# EAGLE schematic ArduinoUhr_VFD_2 (EAGLE 9.2.2)
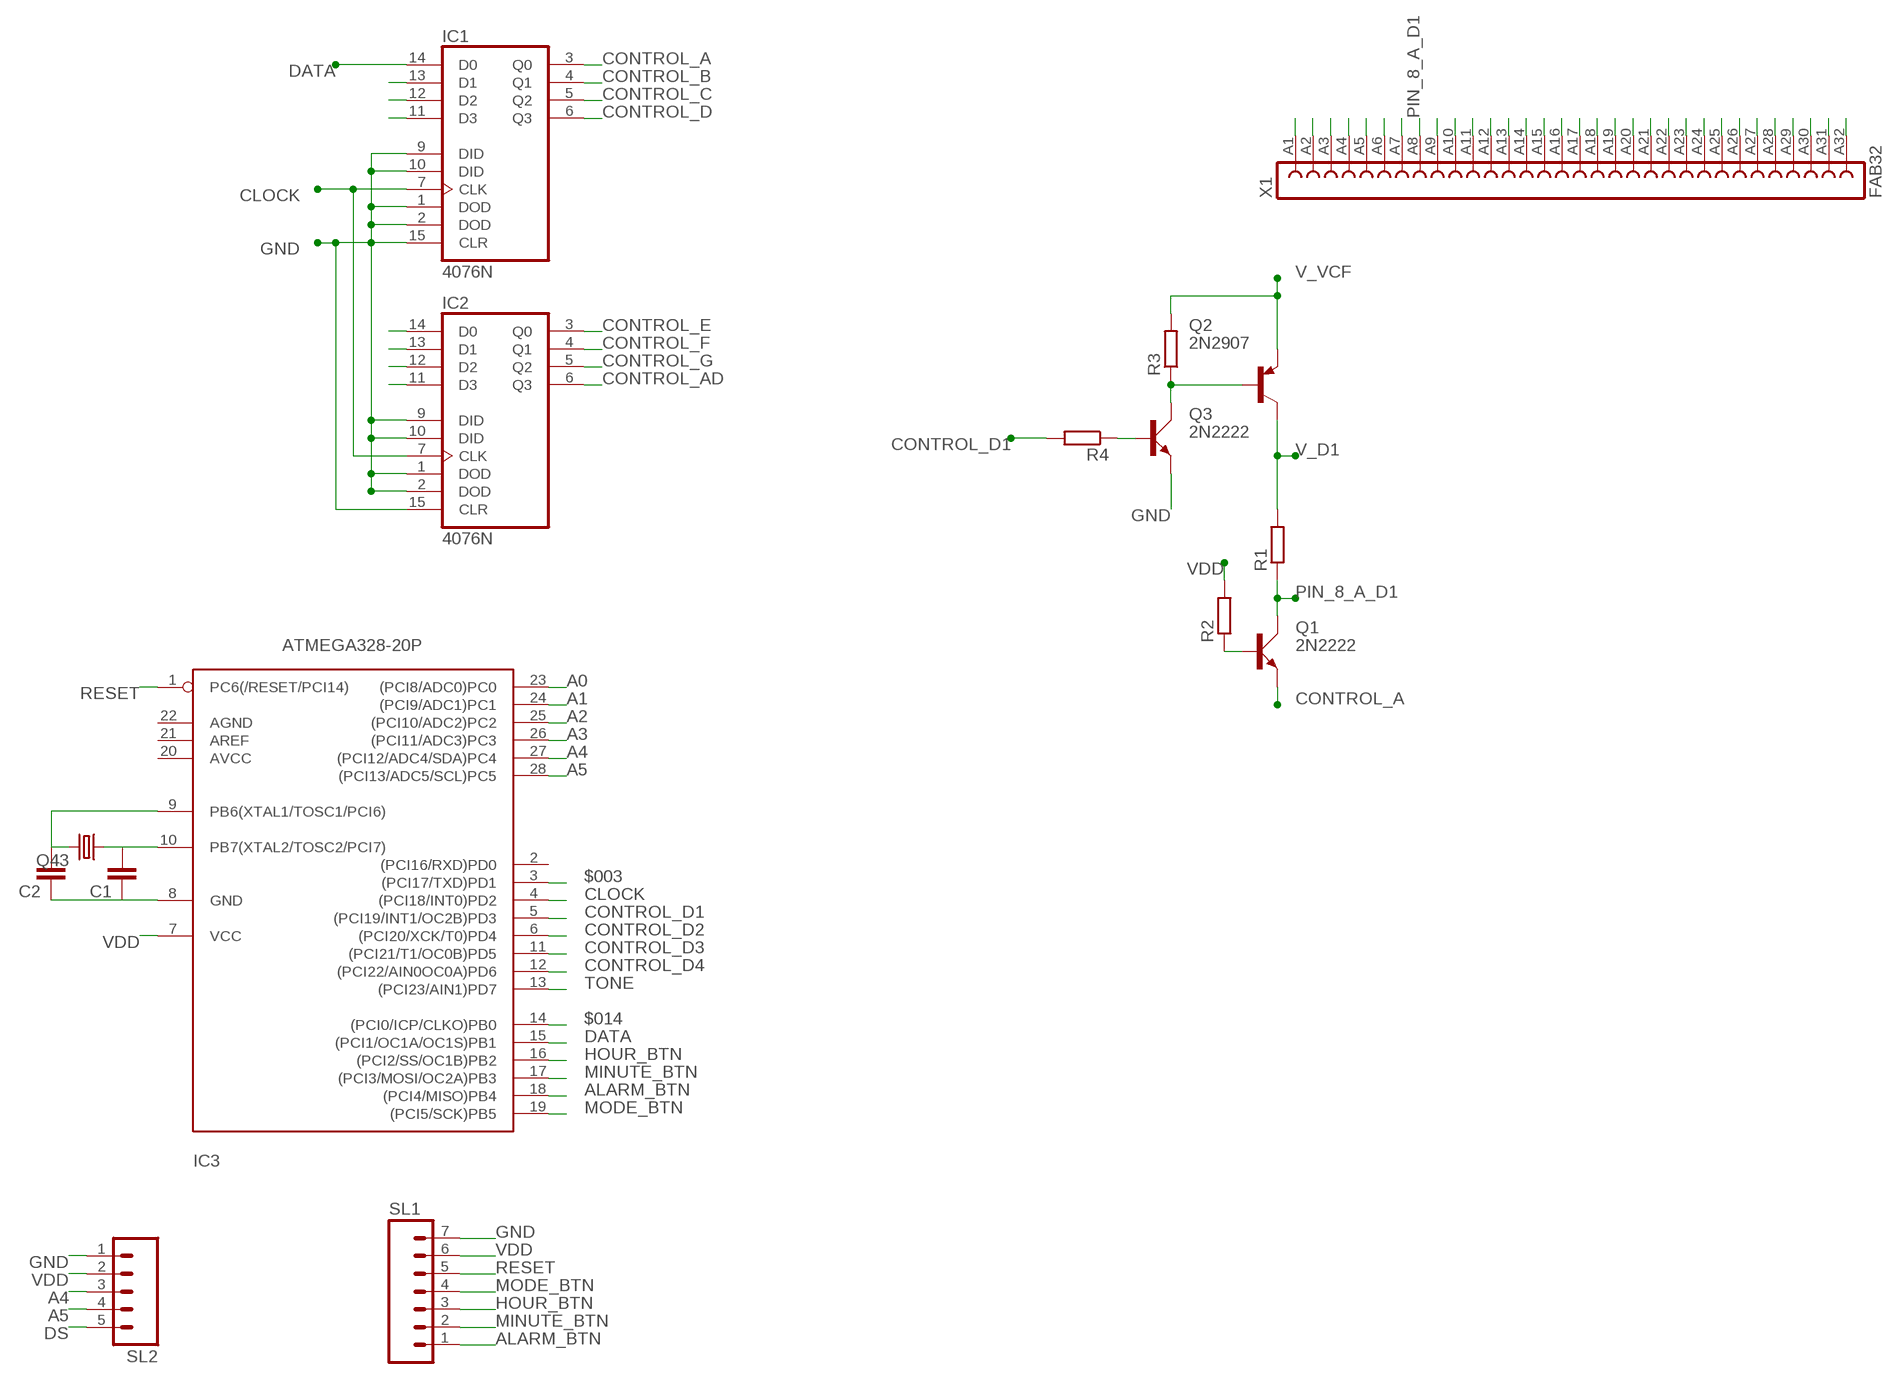
[diagram p0: schematic, sheet 1]

## Parts
C1  C-EU025-024X044  [C025-024X044]
C2  C-EU025-024X044  [C025-024X044]
IC1  4076N  [DIL16]
IC2  4076N  [DIL16]
IC3  ATMEGA328-20P  [DIL28-3]
Q1  2N2222  [TO18A]
Q2  2N2907  [TO18]
Q3  2N2222  [TO18A]
Q43  CRYSTALHC49S  [HC49/S]
R1  R-EU_0204/7  [0204/7]
R2  R-EU_0204/7  [0204/7]
R3  R-EU_0204/7  [0204/7]
R4  R-EU_0204/7  [0204/7]
SL1  M07  [07P]
SL2  M05  [05P]
X1  FAB32  [FAB32]

## Nets
$003: IC3.3((PCI17/TXD)PD1)
$014: IC3.14((PCI0/ICP/CLKO)PB0)
A0: IC3.23((PCI8/ADC0)PC0)
A1: IC3.24((PCI9/ADC1)PC1)
A2: IC3.25((PCI10/ADC2)PC2)
A3: IC3.26((PCI11/ADC3)PC3)
A4: IC3.27((PCI12/ADC4/SDA)PC4) SL2.3
A5: IC3.28((PCI13/ADC5/SCL)PC5) SL2.4
ALARM_BTN: IC3.18((PCI4/MISO)PB4) SL1.1
CLOCK: IC1.7(CLK) IC2.7(CLK) IC3.4((PCI18/INT0)PD2)
CONTROL_A: IC1.3(Q0) IC1.13(D1) Q1.E
CONTROL_AD: IC2.6(Q3)
CONTROL_B: IC1.4(Q1) IC1.12(D2)
CONTROL_C: IC1.5(Q2) IC1.11(D3)
CONTROL_D: IC1.6(Q3) IC2.14(D0)
CONTROL_D1: IC3.5((PCI19/INT1/OC2B)PD3) R4.2
CONTROL_D2: IC3.6((PCI20/XCK/T0)PD4)
CONTROL_D3: IC3.11((PCI21/T1/OC0B)PD5)
CONTROL_D4: IC3.12((PCI22/AIN0OC0A)PD6)
CONTROL_E: IC2.3(Q0) IC2.13(D1)
CONTROL_F: IC2.4(Q1) IC2.12(D2)
CONTROL_G: IC2.5(Q2) IC2.11(D3)
DATA: IC1.14(D0) IC3.15((PCI1/OC1A/OC1S)PB1)
DS: SL2.5
GND: C1.1 C2.1 IC1.1(DOD) IC1.2(DOD) IC1.9(DID) IC1.10(DID) IC1.15(CLR) IC2.1(DOD) IC2.2(DOD) IC2.9(DID) IC2.10(DID) IC2.15(CLR) IC3.8(GND) Q3.E SL1.7 SL2.1
HOUR_BTN: IC3.16((PCI2/SS/OC1B)PB2) SL1.3
MINUTE_BTN: IC3.17((PCI3/MOSI/OC2A)PB3) SL1.2
MODE_BTN: IC3.19((PCI5/SCK)PB5) SL1.4
N$1: Q1.B R2.1
N$3: Q2.2(B) Q3.C R3.1
N$5: Q3.B R4.1
N$18: C1.2 IC3.10(PB7(XTAL2/TOSC2/PCI7)) Q43.1
N$23: C2.2 IC3.9(PB6(XTAL1/TOSC1/PCI6)) Q43.2
PIN1: X1.A1
PIN2: X1.A2
PIN3: X1.A3
PIN4: X1.A4
PIN5: X1.A5
PIN6: X1.A6
PIN7: X1.A7
PIN9: X1.A9
PIN10: X1.A10
PIN11: X1.A11
PIN12: X1.A12
PIN13: X1.A13
PIN14: X1.A14
PIN15: X1.A15
PIN16: X1.A16
PIN17: X1.A17
PIN18: X1.A18
PIN19: X1.A19
PIN20: X1.A20
PIN21: X1.A21
PIN22: X1.A22
PIN23: X1.A23
PIN24: X1.A24
PIN25: X1.A25
PIN26: X1.A26
PIN27: X1.A27
PIN28: X1.A28
PIN29: X1.A29
PIN30: X1.A30
PIN31: X1.A31
PIN32: X1.A32
PIN_8_A_D1: Q1.C R1.1 X1.A8
RESET: IC3.1(PC6(/RESET/PCI14)) SL1.5
TONE: IC3.13((PCI23/AIN1)PD7)
V_D1: Q2.3(C) R1.2
V_VCF: Q2.1(E) R3.2
VDD: IC3.7(VCC) R2.2 SL1.6 SL2.2
Unconnected: IC3.2((PCI16/RXD)PD0) IC3.20(AVCC) IC3.21(AREF) IC3.22(AGND)

## Power pins joined to a net without a drawn wire
VDD: IC1.16(VDD) IC2.16(VDD)
VSS: IC1.8(VSS) IC2.8(VSS)

## Library data of the parts
C1 C2 = rcl:C-EU: CAPACITOR, European symbol; SPICEPREFIX: C
IC1 IC2 = 40xx:4076: Quad D-type REGISTER
IC3 = atmega328:ATMEGA328*P: MICROCONTROLLER 32 kBytes FLASH 2 kBytes SRAM 1 kBytes EEPROM USART 8-channel 10 bit ADC
Q1 Q3 = transistor-small-signal:2N2222: NPN TRANSISTOR
Q2 = transistor-pnp:2N2907*: PNP Transistor
Q43 = crystal:CRYSTAL: CRYSTAL; OC_FARNELL: 1667008; OC_NEWARK: unknown
R1-R4 = rcl:R-EU_: RESISTOR, European symbol; SPICEPREFIX: R
SL1 = con-amp-quick:M07: AMP QUICK CONNECTOR; OC_FARNELL: unknown; OC_NEWARK: unknown
SL2 = con-amp-quick:M05: AMP QUICK CONNECTOR; OC_FARNELL: unknown; OC_NEWARK: unknown
X1 = con-vg:FAB32: CONNECTOR female, 32 pins, block, type B, row A, grid 2.54 mm

## Net classes
0 default: clearance 0.205 mm